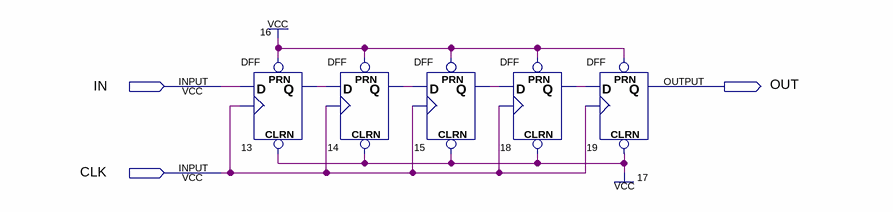
[diagram p0: schematic sheet]
// Quartus schematic sr5.bdf as structural Verilog: 5 symbols, 3 pins
module sr5 (
  input  IN,
  input  CLK,
  output OUT
);

  wire n13_q, n14_q, n15_q, n18_q;

  DFF u_13 (.CLRN(1'b1), .CLK(CLK), .D(IN), .PRN(1'b1), .Q(n13_q));
  DFF u_14 (.CLRN(1'b1), .CLK(CLK), .D(n13_q), .PRN(1'b1), .Q(n14_q));
  DFF u_15 (.CLRN(1'b1), .CLK(CLK), .D(n14_q), .PRN(1'b1), .Q(n15_q));
  DFF u_18 (.CLRN(1'b1), .CLK(CLK), .D(n15_q), .PRN(1'b1), .Q(n18_q));
  DFF u_19 (.CLRN(1'b1), .CLK(CLK), .D(n18_q), .PRN(1'b1), .Q(OUT));
endmodule
